# EAGLE design PCB_RC_01 (EAGLE 9.3.0)
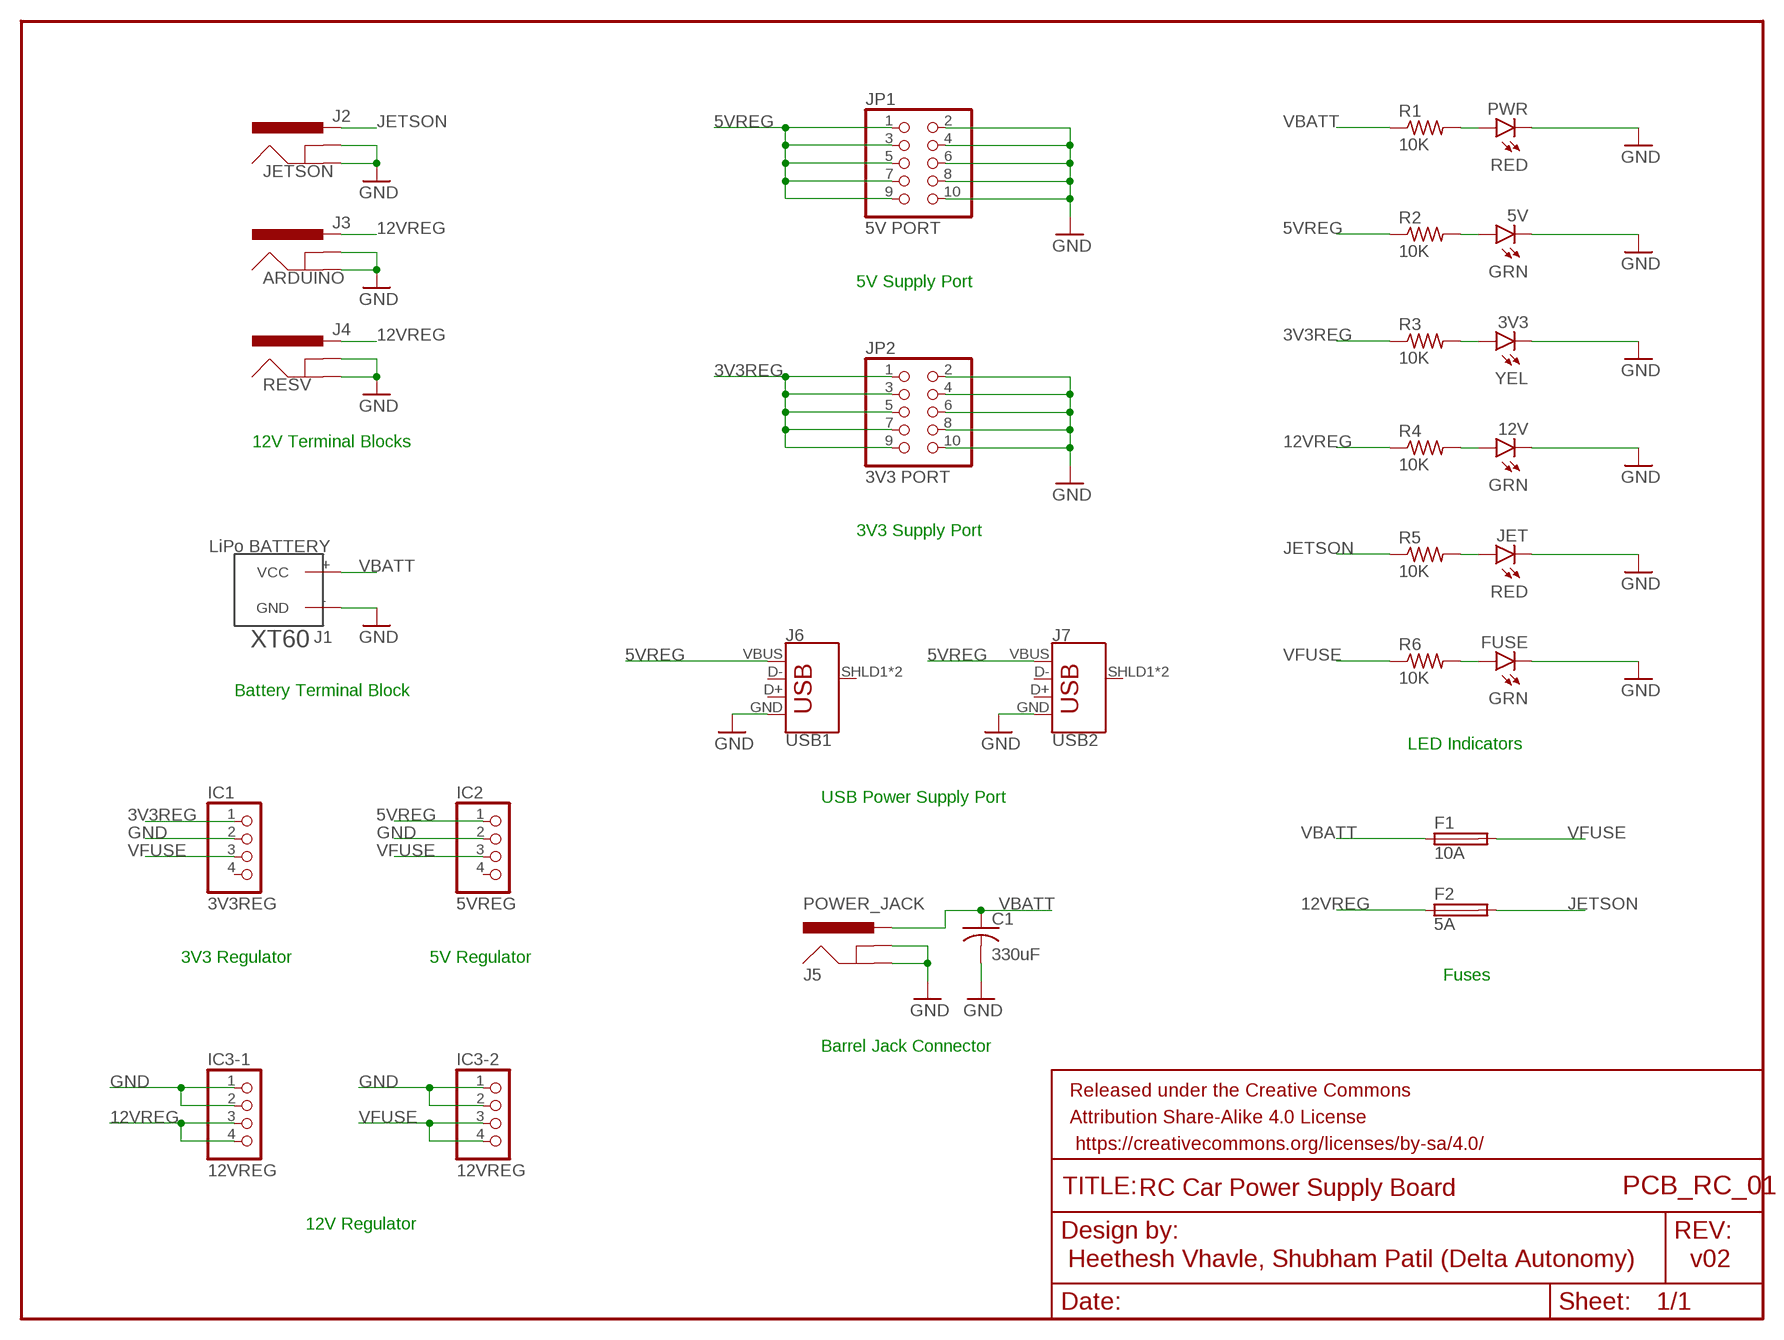
[diagram p0: schematic, sheet 1]

## Parts
3V3  YEL  LED3MM  [LED3MM]
5V  GRN  LED3MM  [LED3MM]
12V  GRN  LED3MM  [LED3MM]
C1  330uF  C-US025-050X050  [C025-050X050]
F1  10A  FUSEBLANK_5X20MM  [FUSE_HOLDER_5X20MM]
F2  5A  FUSEBLANK_5X20MM  [FUSE_HOLDER_5X20MM]
FRAME1  FRAME-LETTERNO_PACKAGE  [DUMMY]
FUSE  GRN  LED3MM  [LED3MM]
IC1  3V3REG  PINHD-1X4  [1X04]
IC2  5VREG  PINHD-1X4  [1X04]
IC3-1  12VREG  PINHD-1X4  [1X04]
IC3-2  12VREG  PINHD-1X4  [1X04]
J1  LiPo BATTERY  XT60  [XT60]
J2  JETSON  POWER_JACK  [POWER_JACK_PTH]
J3  ARDUINO  POWER_JACK  [POWER_JACK_PTH]
J4  RESV  POWER_JACK  [POWER_JACK_PTH]
J5  POWER_JACK  [POWER_JACK_PTH]
J6  USB1  USB_B_PTH  [USB-B-PTH]
J7  USB2  USB_B_PTH  [USB-B-PTH]
JET  RED  LED3MM  [LED3MM]
JP1  5V PORT  PINHD-2X5  [2X05]
JP2  3V3 PORT  PINHD-2X5  [2X05]
PWR  RED  LED3MM  [LED3MM]
R1  10K  R-US_V234/12  [V234/12]
R2  10K  R-US_V234/12  [V234/12]
R3  10K  R-US_V234/12  [V234/12]
R4  10K  R-US_V234/12  [V234/12]
R5  10K  R-US_V234/12  [V234/12]
R6  10K  R-US_V234/12  [V234/12]

## Nets
3V3REG: IC1.1 JP2.1 JP2.3 JP2.5 JP2.7 JP2.9 R3.1
5VREG: IC2.1 J6.VBUS J7.VBUS JP1.1 JP1.3 JP1.5 JP1.7 JP1.9 R2.1
12VREG: F2.1 IC3-1.3 IC3-1.4 J3.PWR J4.PWR R4.1
GND: 3V3.K(C) 5V.K(C) 12V.K(C) C1.2 FUSE.K(C) IC1.2 IC2.2 IC3-1.1 IC3-1.2 IC3-2.1 IC3-2.2 J1.-(GND) J2.GND J2.GNDBREAK J3.GND J3.GNDBREAK J4.GND J4.GNDBREAK J5.GND J5.GNDBREAK J6.GND J7.GND JET.K(C) JP1.2 JP1.4 JP1.6 JP1.8 JP1.10 JP2.2 JP2.4 JP2.6 JP2.8 JP2.10 PWR.K(C)
JETSON: F2.2 J2.PWR R5.1
N$1: PWR.A R1.2
N$2: 5V.A R2.2
N$3: 3V3.A R3.2
N$4: 12V.A R4.2
N$5: JET.A R5.2
N$6: FUSE.A R6.2
VBATT: C1.1 F1.1 J1.+(VCC) J5.PWR R1.1
VFUSE: F1.2 IC1.3 IC2.3 IC3-2.3 IC3-2.4 R6.1
Unconnected: IC1.4 IC2.4 J6.D+ J6.D- J6.SHLD1(SHIELD) J6.SHLD2(SHIELD) J7.D+ J7.D- J7.SHLD1(SHIELD) J7.SHLD2(SHIELD)

## Notes on the sheet
- 5V Supply Port
- 12V Terminal Blocks
- 3V3 Supply Port
- Battery Terminal Block
- LED Indicators
- USB Power Supply Port
- 3V3 Regulator | 5V Regulator
- Fuses
- Barrel Jack Connector
- RC Car Power Supply Board
- 12V Regulator
- Heethesh Vhavle, Shubham Patil (Delta Autonomy) | v02

## Library data of the parts
3V3 5V 12V FUSE JET PWR = led:LED: LED OSRAM: - CHIPLED LG R971, LG N971, LY N971, LG Q971, LY Q971, LO R971, LY R971 LH N974, LH R974 LS Q976, LO Q976, LY Q976 LO Q996 - Hyper CHIPLED LW Q18S LB Q993, LB Q99A, LB R99A - SideLED LS A670, LO A670, LY A670, LG A670, LP A670 LB A673, LV A673, LT A673, LW A673 LH A674 LY A675 LS A676, LA A676, LO A676, LY A676, LW A676 LS A679, LY A679, LG A679 - Hyper Micro SIDELED® LS Y876, LA Y876, LO Y876, LY Y876 LT Y87S - SmartLED LW L88C, LW L88S LB L89C, LB L89S, LG L890 LS L89K, LO L89K, LY L89K LS L896, LA L896, LO L896, LY L896 - TOPLED LS T670, LO T670, LY T670, LG T670, LP T670 LSG T670, LSP T670, LSY T670, LOP T670, LYG T670 LG T671, LOG T671, LSG T671 LB T673, LV T673, LT T673, LW T673 LH T674 LS T676, LA T676, LO T676, LY T676, LB T676, LH T676, LSB T676, LW T676 LB T67C, LV T67C, LT T67C, LS T67K, LO T67K, LY T67K, LW E67C LS E67B, LA E67B, LO E67B, LY E67B, LB E67C, LV E67C, LT E67C LW T67C LS T679, LY T679, LG T679 LS T770, LO T770, LY T770, LG T770, LP T770 LB T773, LV T773, LT T773, LW T773 LH T774 LS E675, LA E675, LY E675, LS T675 LS T776, LA T776, LO T776, LY T776, LB T776 LHGB T686 LT T68C, LB T68C - Hyper Mini TOPLED® LB M676 - Mini TOPLED Santana® LG M470 LS M47K, LO M47K, LY M47K Source: http://www.osram.convergy.de LUXEON: - LUMILED® LXK2-PW12-R00, LXK2-PW12-S00, LXK2-PW14-U00, LXK2-PW14-V00 LXK2-PM12-R00, LXK2-PM12-S00, LXK2-PM14-U00 LXK2-PE12-Q00, LXK2-PE12-R00, LXK2-PE12-S00, LXK2-PE14-T00, LXK2-PE14-U00 LXK2-PB12-K00, LXK2-PB12-L00, LXK2-PB12-M00, LXK2-PB14-N00, LXK2-PB14-P00, LXK2-PB14-Q00 LXK2-PR12-L00, LXK2-PR12-M00, LXK2-PR14-Q00, LXK2-PR14-R00 LXK2-PD12-Q00, LXK2-PD12-R00, LXK2-PD12-S00 LXK2-PH12-R00, LXK2-PH12-S00 LXK2-PL12-P00, LXK2-PL12-Q00, LXK2-PL12-R00 Source: www.luxeon.com KINGBRIGHT: KA-3528ASYC Source: www.kingbright.com
C1 = rcl:C-US: CAPACITOR, American symbol; SPICEPREFIX: C
F1 F2 = fuse:FUSE: Fuse; OC_FARNELL: unknown; OC_NEWARK: unknown
FRAME1 = SparkFun-Aesthetics:FRAME-LETTER: Schematic Frame - Letter Standard 8.5x11 US Letter frame; DESIGNER: Shubham Patil, Heethesh Vhavle; VERSION: v01
IC1 IC2 IC3-1 IC3-2 = pinhead:PINHD-1X4: PIN HEADER
J1 = XT60:XT60: XT60
J2-J5 = SparkFun-Connectors:POWER_JACK: Power Jack Connector This is the standard 5.5mm barrel jack for power. The PTH is the most common, proven, reliable, footprint. The Slot footprint only works if the mill layer is transmitted to the PCB fab house so be warned. Here are the connectors we sell at SparkFun: DC Barrel Power Jack/Connector <https://www.sparkfun.com/products/119> (PRT-00119) DC Barrel Power Jack/Connector (SMD) <https://www.sparkfun.com/products/12748> (PRT-12748) DC Barrel Jack Adapter - Breadboard Compatible <https://www.sparkfun.com/products/10811> (PRT-10811) It is used on this SparkFun product (and many, many others): SparkFun RedBoard - Programmed with Arduino <https://www.sparkfun.com/products/12757> (DEV-12757) Also, if you need a mating power supply or connector, please check these out: Wall Adapter Power Supply - 9VDC 650mA <https://www.sparkfun.com/products/298> (TOL-00298) DC Barrel Jack Adapter - Male <https://www.sparkfun.com/products/10287> (PRT-10287); PROD_ID: CONN-08197
J6 J7 = SparkFun-Connectors:USB_B: USB Type B Connector SparkFun Products: SparkFun Stepoko <https://www.sparkfun.com/products/13899> PTH; PROD_ID: CONN-08278; SF_ID: PRT-00139
JP1 JP2 = pinhead:PINHD-2X5: PIN HEADER
R1-R6 = rcl:R-US_: RESISTOR, American symbol

## Board
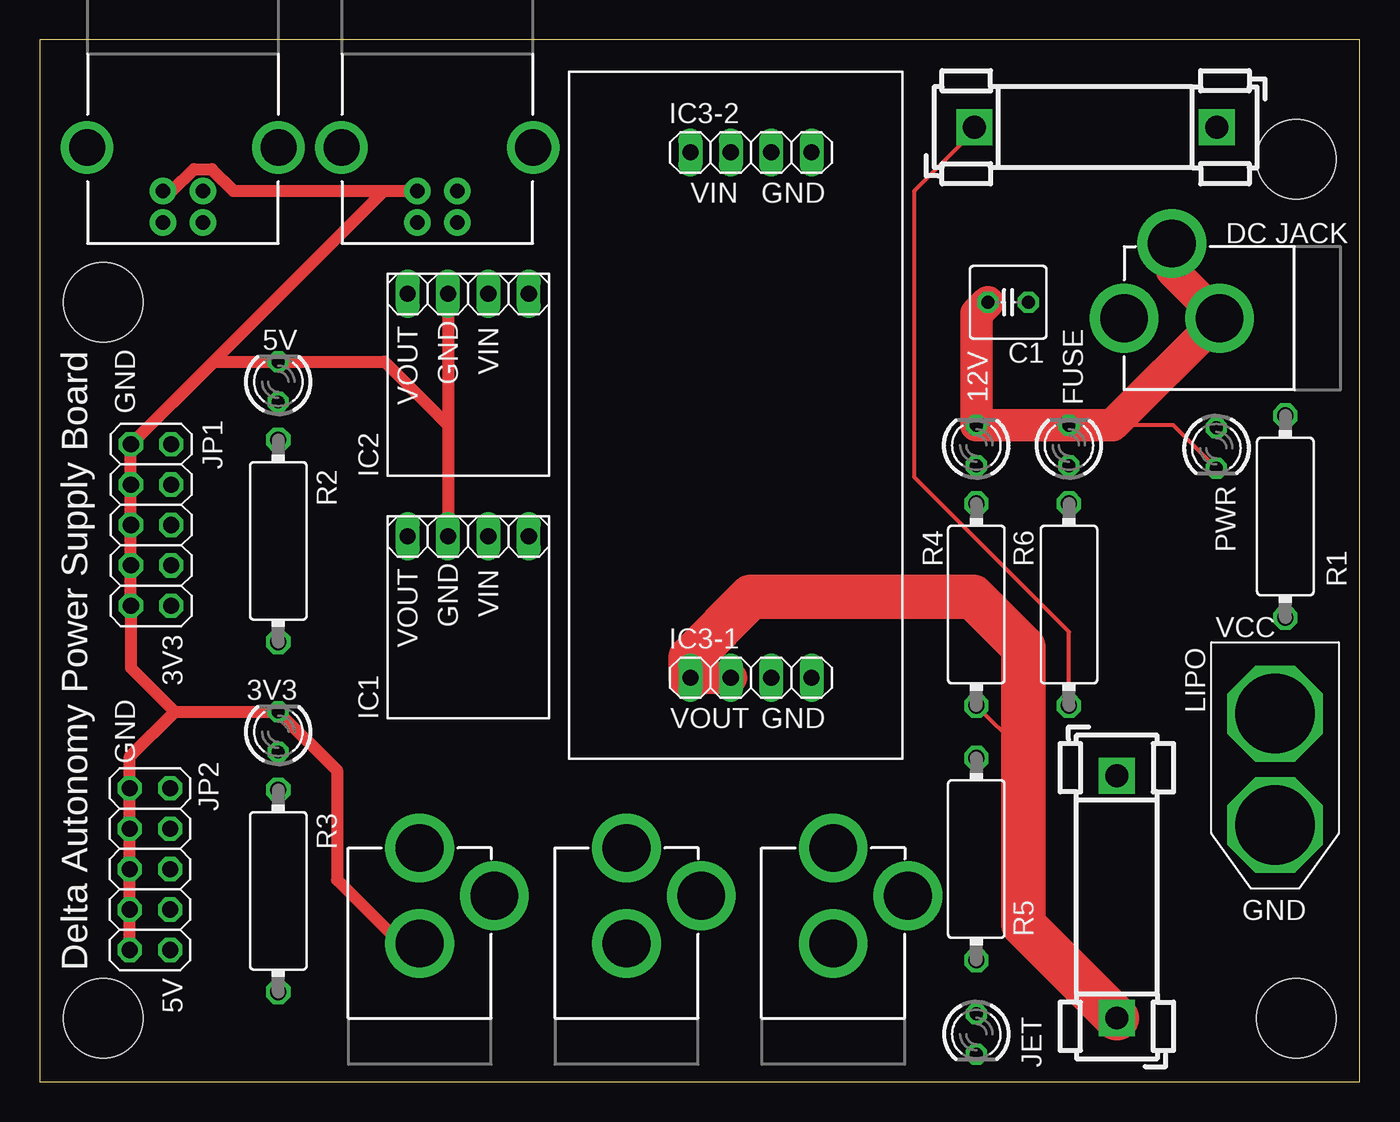
[diagram p1: board, top side]
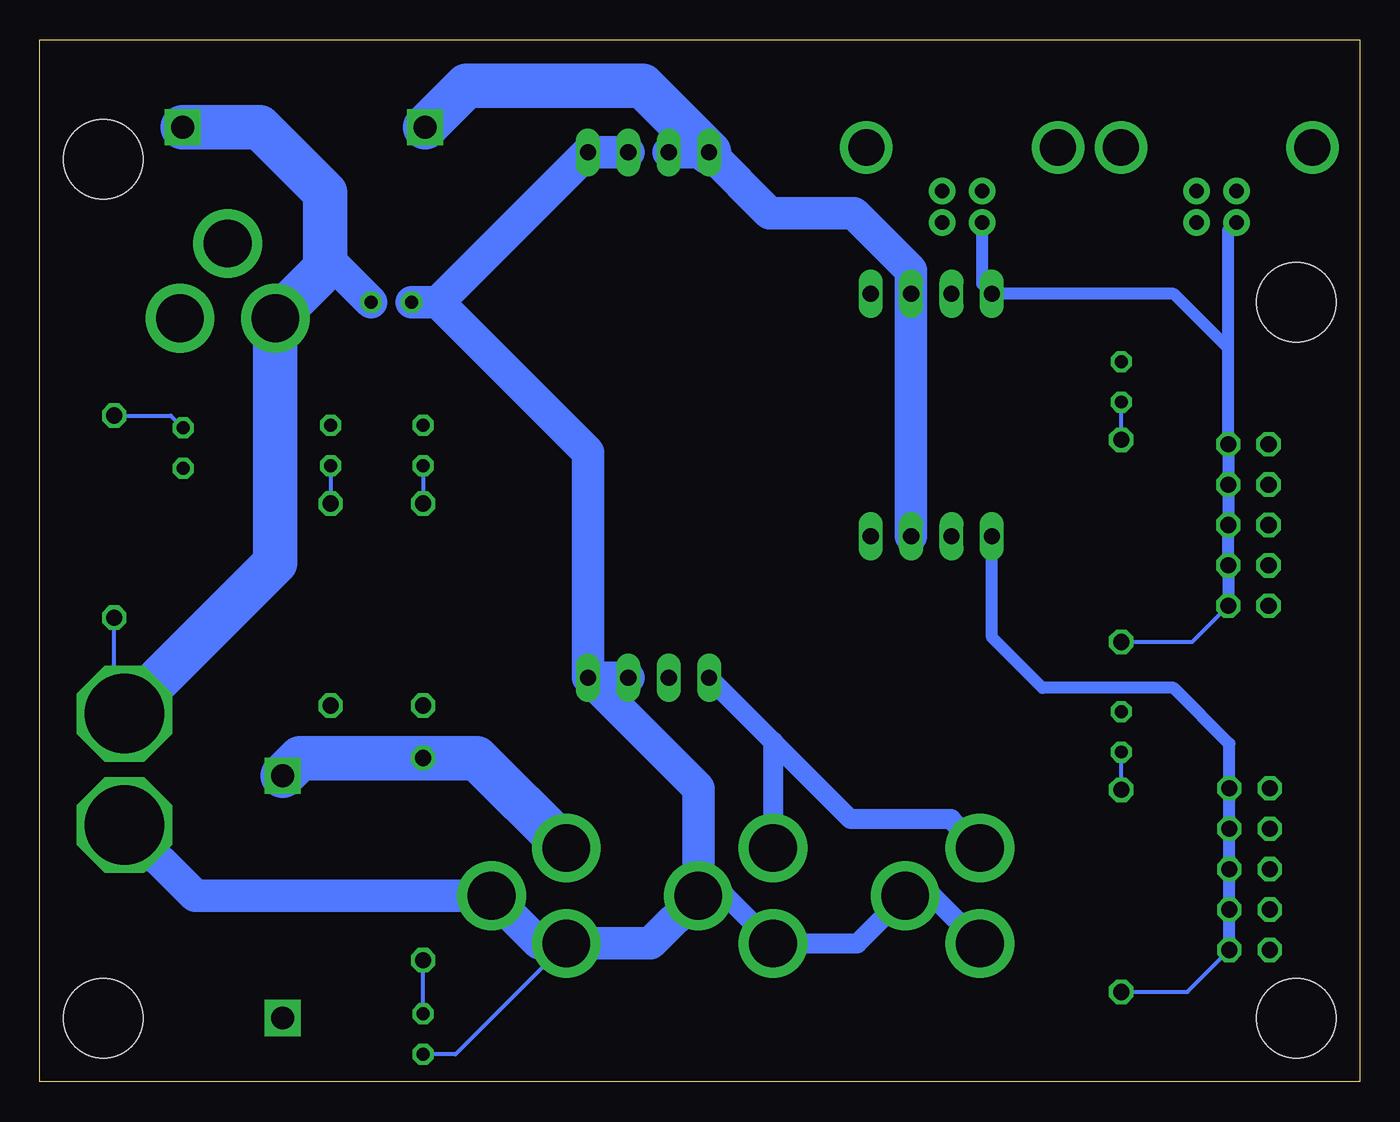
[diagram p2: board, bottom side, seen from below]

Size 83 x 65.5 mm. Coordinates in mm from the lower left corner, seen from the top.
Outline: 0,0 83,0 83,65.5 0,65.5 0,0
Copper layers (1*16): Top 0.035mm / dielectric 1.5mm / Bottom 0.035mm
Design rules "default": minimum track width 6mil, minimum drill 0.35mm, track to track 6mil, track to pad 6mil, pad to pad 6mil, via to via 6mil, smd to smd 6mil, copper to edge 40mil, drill to drill 6mil, minimum pad ring 10mil, minimum via ring 8mil, stop-mask expansion 4mil, vias tented up to drill 0mil, thermal gap 10mil
Holes 5 mm at 79,4 79,58 4,49 4,4

### Footprints (pad centres in the part's own frame; a part is rotated, then mirrored left to right if it is on the bottom)
LED3MM = drill 0.813 octagon: A -1.27,0; K 1.27,0
C025-050X050 = drill 0.813 octagon: 1 -1.27,0; 2 1.27,0
FUSE_HOLDER_5X20MM = drill 1.422 pad 2.286 square: 1 0,0; 2 15.24,0
1X04 = drill 1.016 long: 1 -3.81,0; 2 -1.27,0; 3 1.27,0; 4 3.81,0
XT60 = drill 5 octagon: + 4.5,0; - 11.5,0
POWER_JACK_PTH = drill 2.997 pad 4.318: GND 0,7.7; GNDBREAK 4.7,10.7; PWR 0,13.7
USB-B-PTH = drill 0.914 pad 1.676: D+ 4,1.25; D- 5.981,1.25; GND 4,-1.25; VBUS 5.981,-1.25 | drill 2.286: SHLD1 1.282,-6.02; SHLD2 1.282,6.02
2X05 = drill 1.016 octagon: 1 -5.08,-1.27; 2 -5.08,1.27; 3 -2.54,-1.27; 4 -2.54,1.27; 5 0,-1.27; 6 0,1.27; 7 2.54,-1.27; 8 2.54,1.27; 9 5.08,-1.27; 10 5.08,1.27
V234/12 = drill 1.016 octagon: 1 -6.35,0; 2 6.35,0

### Placement (x,y rotation side)
3V3  15,22 90 top
5V  15,44 90 top
12V  58.89,40 90 top
C1  60.89,49 180 top
F1  74.01,60 180 top
F2  67.73,4 90 top
FRAME1  -51.8,73.66 0 top  (outside the outline)
FUSE  64.72,40 90 top
IC1  26.94,34.29 0 top
IC2  26.94,49.53 0 top
IC3-1  44.72,25.4 180 top
IC3-2  44.72,58.42 180 top
J1  77.68,27.64 270 top
J2  49.89,1 0 top
J3  36.89,1 0 top
J4  23.89,1 0 top
J5  81.89,48 90 top
J6  25,60 270 top
J7  9,60 270 top
JET  58.89,3 270 top
JP1  7,35 90 top
JP2  6.93,13.37 90 top
PWR  73.98,39.83 270 top
R1  78.32,35.53 90 top
R2  15,34 90 top
R3  15,12 90 top
R4  58.89,30 90 top
R5  58.89,14 270 top
R6  64.72,30 90 top

### Tracks (layer width: path | path; a pad name or v marks a point on that pad's centre or on a via)
3V3REG
  Bottom 0.254: R3.1 10.84,5.65 JP2.1
  Bottom 0.762: JP2.9 8.2,21.27 11.7,24.77 19.95,24.77 23.13,27.94 IC1.1 | JP2.1 JP2.3 JP2.5 JP2.9 | JP2.7 JP2.9
5VREG
  Bottom 0.254: R2.1 10.54,27.65 JP1.1
  Bottom 0.762: JP1.9 8.27,53.5 J7.VBUS | JP1.9 8.27,46.1 11.7,49.53 IC2.1 23.75,50.15 J6.VBUS | JP1.9 JP1.7 JP1.5 8.27,34.92 JP1.3 | JP1.3 JP1.1 JP1.3
12VREG
  Top 0.254: R4.1 61.59,20.95
  Top 1.27: 61.59,20.95 61.87,20.95
  Top 2.032: IC3-1.4 IC3-1.3
  Top 2.794: F2.1 61.87,9.87 61.87,20.95 61.87,27.3 58.69,30.48 44.72,30.48 40.91,26.67 IC3-1.4
  Bottom 1.27: 36.89,21.38 J3.PWR | J4.PWR 25.7,16.51 32.02,16.51 36.89,21.38 | IC3-1.4 36.89,21.38
GND
  Top 0.254: PWR.K 71.28,41.27 FUSE.K
  Top 0.762: J7.GND 8.31,56 9.68,57.37 10.82,57.37 12.19,56 21.65,56 | J6.GND 22,56 21.65,56 | IC2.2 25.67,41.27 | 25.67,41.27 IC1.2 | JP1.10 10.92,45.27 5V.K 21.68,45.27 25.67,41.27 | 8.48,23.27 3V3.K 18.68,19.59 18.68,12.7 22.68,8.7 J4.GND | 8.48,23.27 5.73,26.02 JP1.2 JP1.4 JP1.6 JP1.10 | JP1.8 JP1.10 | JP2.2 JP2.4 JP2.6 JP2.10 | JP2.8 JP2.10 | JP2.10 5.66,20.45 8.48,23.27 | JP1.10 21.65,56
  Top 2.032: J5.GNDBREAK 71.19,51 J5.GND 67.46,41.27 FUSE.K 12V.K 58.89,48.27 C1.2
  Bottom 0.254: J2.GND 56.86,1.73 JET.K
  Bottom 1.27: J3.GNDBREAK 39.89,11.7 J3.GND 31.59,8.7 J4.GNDBREAK 26.89,11.7 J4.GND
  Bottom 2.032: J1.- 73.24,11.7 J2.GNDBREAK 51.59,8.7 J2.GND 44.59,8.7 J3.GNDBREAK 41.59,18.46 IC3-1.1 | IC3-1.2 IC3-1.1 | IC3-2.2 IC3-2.1 57.95,49 | IC3-1.1 48.53,39.58 57.95,49 | C1.2 57.95,49
JETSON
  Bottom 2.794: F2.2 66.62,20.35 R5.1 55.54,20.35 J2.PWR
N$1
  Bottom 0.254: R1.2 74.77,41.88 PWR.A
N$2
  Bottom 0.254: R2.2 5V.A
N$3
  Bottom 0.254: R3.2 3V3.A
N$4
  Bottom 0.254: 12V.A R4.2
N$5
  Bottom 0.254: JET.A R5.2
N$6
  Bottom 0.254: FUSE.A R6.2
VBATT
  Bottom 0.254: J1.+ 78.32,23.78 R1.1
  Bottom 2.032: C1.1 65.04,51.88 65.04,53.34
  Bottom 2.794: J1.+ 68.19,32.63 J5.PWR 65.04,51.15 65.04,53.34 65.04,55.88 69.16,60 F1.1
VFUSE
  Top 0.254: R6.1 64.72,28.29 55,38 55,56 58.77,59.77 F1.2
  Bottom 2.032: IC1.3 IC2.3 28.21,51.02 31.8,54.61 37.1,54.61 IC3-2.4 IC3-2.3
  Bottom 2.794: IC3-2.4 45.1,62.61 56.16,62.61 F1.2

### Text on the board
tPlace: VIN | GND | DC JACK | GND | VIN | VOUT | GND | GND | VIN | VCC | VOUT | LIPO | 3V3 | VOUT | GND | GND | GND | Delta Autonomy Power Supply Board | 5V